# EAGLE design B5_EM_+Y_SOLAR_PANEL (EAGLE 9.6.2)
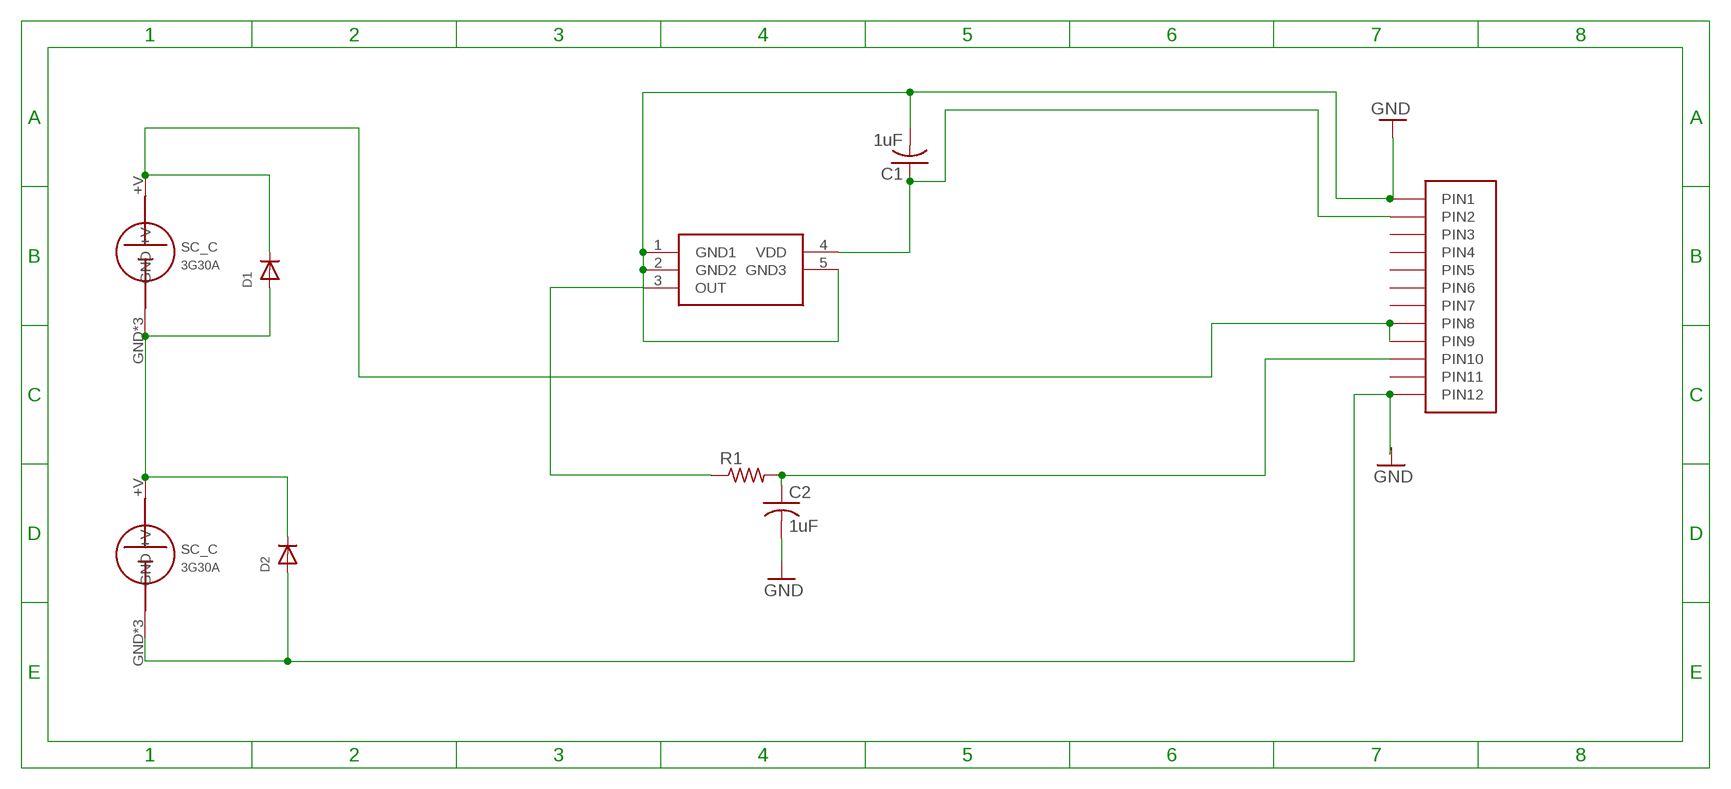
[diagram p0: schematic, sheet 1]

## Parts
C1  1uF  C-USC0805  [C0805]
C2  1uF  C-USC0805  [C0805]
D1  DIODE_SOD-123FL  [SOD-123FL]
D2  DIODE_SOD-123FL  [SOD-123FL]
R1  R-US_R0402  [R0402]
U$1  HEADER12PIN  [HEADER12PIN]
U$3  LMT84DCKT  [SOT65P210X110-5N]
U$4  SC_C  [SC_C]
U$5  SC_C  [SC_C]

## Nets
GND: C1.2 C2.2 D2.A U$1.P1(PIN1) U$1.P12(PIN12) U$3.1(GND1) U$3.2(GND2) U$3.5(GND3) U$4.GND U$4.GND1(GND) U$4.GND2(GND)
N$2: R1.1 U$3.3(OUT)
N$3: C2.1 R1.2 U$1.P10(PIN10)
N$5: D1.A D2.C U$4.+V U$5.GND U$5.GND1(GND) U$5.GND2(GND)
N$6: D1.C U$1.P8(PIN8) U$1.P9(PIN9) U$5.+V
N$10: C1.1 U$1.P2(PIN2) U$3.4(VDD)
Unconnected: U$1.P3(PIN3) U$1.P4(PIN4) U$1.P5(PIN5) U$1.P6(PIN6) U$1.P7(PIN7) U$1.P11(PIN11)

## Library data of the parts
C1 C2 = adafruit:C-US: CAPACITOR, American symbol
D1 D2 = adafruit:DIODE: Diode SMADIODE - SMA Surface Mount Package 20V 1A Schottky Diode Digikey: 641-1014-6-ND DO-1N4148 - Through Hole Small Current Diode SOD-123 20V 1 A (.5mV Vf) Schottky Diode - Digikey: MBRX120TPMSCT-ND SOD-323 10V 570mA (.38mV Vf, 3ns) Schottky Diode - Digikey: ZLLS410CT-ND SOD-523 30V 30mA Schottky Diode (RB751S-40TE61) - Digikey: RB751S-40TE61CT-ND SOT23-R/W - SOT23 Package (R = Solder Paste/Reflow Ovens, W = Hand-Soldering) BAT54Film 40V 300mA - Digikey: 497-7162-1-ND
R1 = adafruit:R-US_: RESISTOR, American symbol
U$1 = BIRDS:HEADER12PIN
U$3 = LMT84DCKT:LMT84DCKT: 1.5V-Capable, 10 uA Analog Output Temperature Sensor in SC70 and TO-92 Source: Datasheet <http://uk.rs-online.com/web/p/products/8115860>; DESCRIPTION: 1.5V-Capable, 10 uA Analog Output Temperature Sensor in SC70 and TO-92; HEIGHT: 1.1mm; MANUFACTURER_NAME: Texas Instruments; MANUFACTURER_PART_NUMBER: LMT84DCKT; RS_PART_NUMBER: 8115860
U$4 U$5 = SC_C:SC_C

## Board
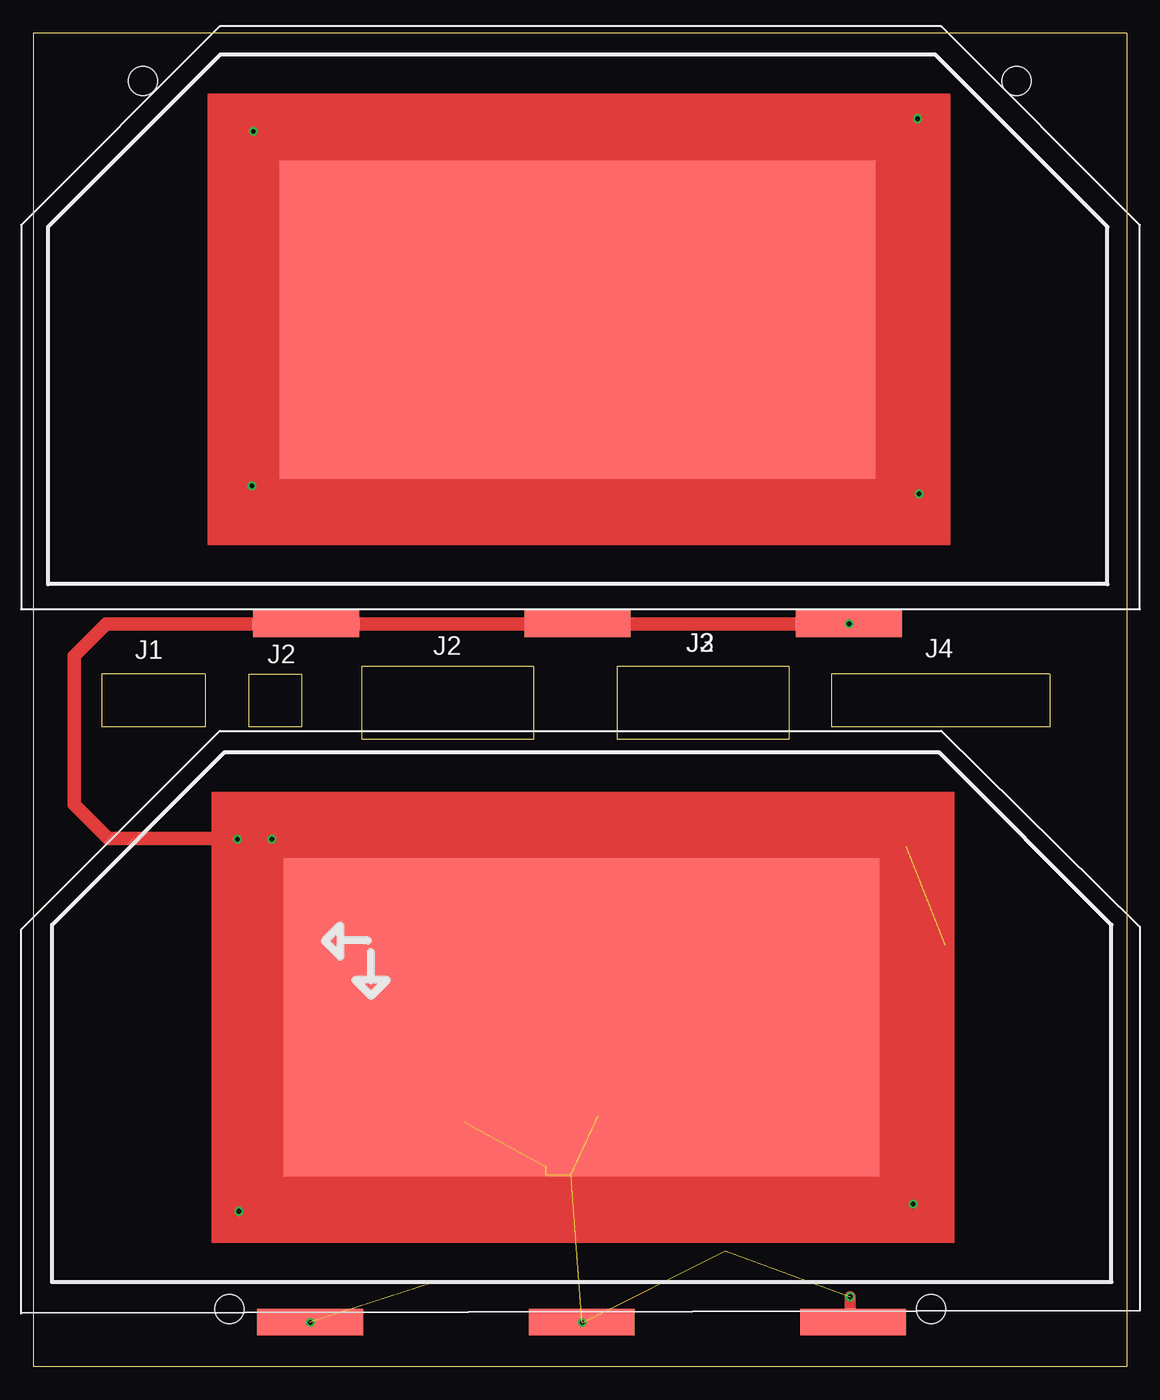
[diagram p1: board, top side]
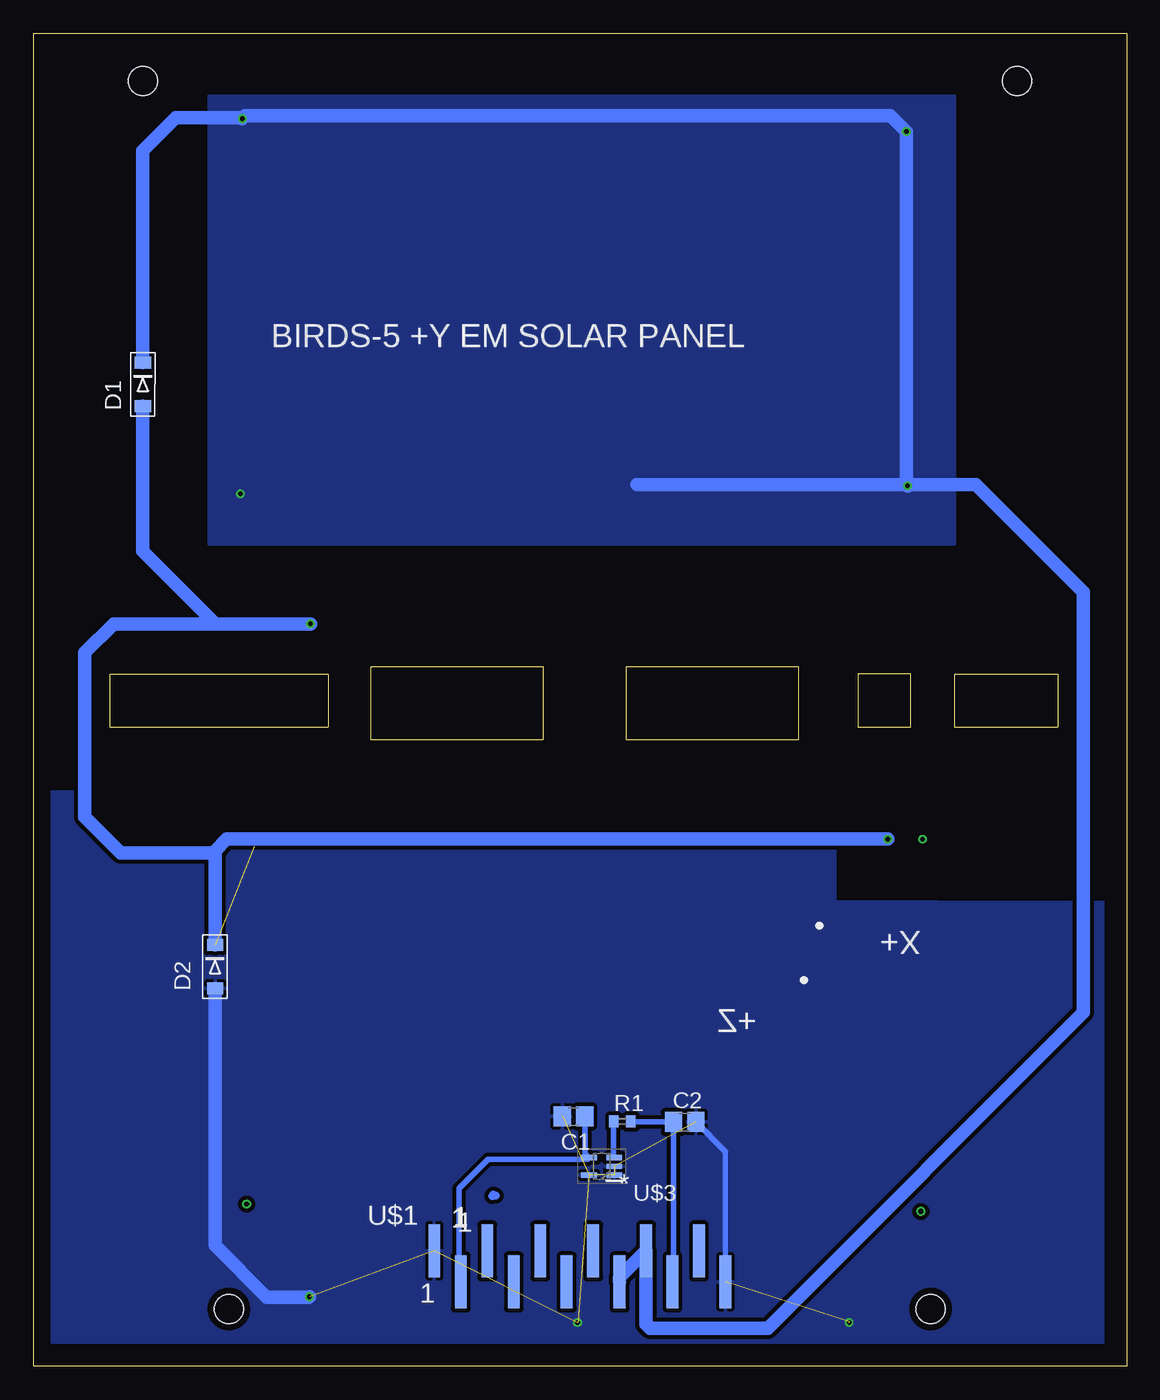
[diagram p2: board, bottom side, seen from below]

Size 82.6 x 100.7 mm. Coordinates in mm from the lower left corner, seen from the top.
Outline: 0,0 82.6,0 82.6,100.7 0,100.7 0,0
Outline: 13,52.3 5.2,52.3 5.2,48.3 13,48.3 13,52.3
Outline: 16.3,52.3 20.3,52.3 20.3,48.3 16.3,48.3 16.3,52.3
Outline: 37.8,52.85 24.8,52.85 24.8,47.35 37.8,47.35 37.8,52.85
Outline: 57.1,52.85 44.1,52.85 44.1,47.35 57.1,47.35 57.1,52.85
Outline: 76.8,52.3 60.3,52.3 60.3,48.3 76.8,48.3 76.8,52.3
Copper layers (1+2*15+16): Top 0.018mm / dielectric 0.25mm / Route2 0.035mm / dielectric 1mm / Route15 0.035mm / dielectric 0.25mm / Bottom 0.018mm
Design rules "pban_5mil-l4": minimum track width 5mil, minimum drill 0.3mm, track to track 5mil, track to pad 0.229mm, pad to pad 5mil, via to via 5mil, smd to smd 5mil, copper to edge 0.5mm, drill to drill 0.5mm, minimum pad ring 0.15mm, minimum via ring 0.15mm, stop-mask expansion 4mil, vias tented up to drill 0.35mm, thermal gap 10mil
Holes 2.2 mm at 14.81,4.34 67.81,4.34 8.29,97.09 74.29,97.09

### Footprints (pad centres in the part's own frame; a part is rotated, then mirrored left to right if it is on the bottom)
C0805 = smd 1.3 x 1.5: 1 -0.85,0; 2 0.85,0
SOD-123FL = smd 0.91 x 1.22 bottom: A 1.637,0; C -1.637,0
R0402 = smd 0.7 x 0.9: 1 -0.65,0; 2 0.65,0
HEADER12PIN = smd 4 x 0.89: P1 0,0; P2 2.35,2; P3 0,4; P4 2.35,6; P5 0,8; P6 2.35,10; P7 0,12; P8 2.35,14; P9 0,16; P10 2.35,18; P11 0,20; P12 2.35,22
SOT65P210X110-5N = smd 1.2 x 0.4: 1 -0.95,0.65; 2 -0.95,0; 3 -0.95,-0.65; 4 0.95,-0.65; 5 0.95,0.65
SC_C = smd 45 x 24 bottom: +V 40.1,20 | smd 8 x 2 bottom: GND 40.1,-3; GND1 19.6,-3; GND2 60.6,-3

### Placement (x,y rotation side)
C1  41.78,18.88 180 bottom
C2  33.39,18.46 0 bottom
D1  74.31,74.18 270 top
D2  68.86,30.2 270 top
R1  38.1,18.5 0 bottom
U$1  52.3,8.72 270 bottom
U$3  39.65,15.11 180 bottom
U$4  81.54,6.36 0 bottom
U$5  81.24,59.07 0 bottom

### Tracks (layer width: path | path; a pad name or v marks a point on that pad's centre or on a via)
GND  (via drill 0.35)  (10 unrouted)
  Top 0.813: U$4.GND1 61.72,3.57 v61.72,5.26
  Bottom 0.406: U$1.P12 30.3,16.22 C2.2
  Bottom 1.016: D2.A 68.86,9.15 64.95,5.23 61.75,5.23 v61.72,5.26
  other vias: 20.95,3.3 41.48,3.3
  pour Bottom (isolate 0.3): 14.25,35.1 21.97,35.1 21.97,43.43 81.23,43.43 81.23,1.8 1.73,1.8 1.73,32.74 1.73,35.08 14.22,35.08
N$2
  Bottom 0.406: R1.1 38.75,15.81 U$3.3
N$3
  Bottom 0.406: U$1.P10 34.24,6.43 C2.1 37.41,18.46 R1.2
N$5  (via drill 0.35)  (1 unrouted)
  Top 0.813: U$4.+V 41.44,17.36 39.04,14.96
  Top 1.016: v18.03,39.83 29.97,39.83 41.35,28.45 41.35,22.71 37.97,22.71 37.97,24.61 39.06,25.7 | U$4.+V 27.97,39.83 v18.03,39.83 | U$5.GND U$5.GND2 5.53,56.07 3.1,53.65 3.1,42.44 5.66,39.88 15.37,39.88 v15.42,39.83 v18.03,39.83 | U$5.GND 41.41,56.07 41.73,55.75 41.45,55.75 U$5.GND | U$5.GND U$5.GND1 | U$5.GND1 62.4,56.07 62.41,56.08 v61.65,56.08 U$5.GND1 | 65.91,39.27 57.78,39.27 42.29,23.77 43.79,22.28 | 43.79,22.28 53.9,12.17 66.37,12.17 v66.47,12.27 | v15.54,11.71 28.93,25.09 40.41,25.09 40.41,25.76 43.79,22.38 43.79,22.28
  Bottom 1.016: 68.86,38.94 D2.C | D1.A 74.31,61.58 68.81,56.08 v61.65,56.08 76.53,56.08 78.72,53.9 78.72,41.5 76,38.79 69.01,38.79 68.86,38.94 | v18.03,39.83 67.97,39.83 68.86,38.94
N$6  (via drill 0.35)
  Top 1.016: U$5.+V 30.83,79.07 v16.64,93.27 | U$5.+V 56.3,94.23 v66.8,94.23 | U$5.+V 28.46,66.4 17.04,66.4 17.04,76.5 56.34,76.5 v66.93,65.91
  Bottom 1.016: D1.C 74.31,91.84 71.83,94.31 66.88,94.31 v66.8,94.23 66.57,94.46 17.83,94.46 v16.64,93.27 16.64,66.6 | 16.64,66.6 v16.54,66.5 | 36.98,66.6 16.64,66.6 | U$1.P8 38.3,6.72 U$1.P9 36.3,3.18 36.02,2.9 27.1,2.9 3.28,26.72 3.28,58.47 3.43,58.62 3.71,58.9 11.4,66.6 16.64,66.6
  pour Bottom (isolate 0.3): 69.39,96.01 69.39,62.08 12.95,62.08 12.95,95.96
N$10
  Bottom 0.406: C1.1 40.93,16.09 U$3.4 40.72,15.65 48.23,15.65 50.42,13.46 50.42,7.9 50.22,7.7 50.22,6.46 U$1.P2
  Bottom 0.61: 47.66,12.89 47.83,12.97 47.93,12.87 47.66,12.89

### Text on the board
tPlace: J2 | J2 | J3 | J4 | J1 | J2
bPlace: BIRDS-5 +Y EM SOLAR PANEL | +X | +Z
bNames: * | U$1 | 1 | 1 | 1 | 1